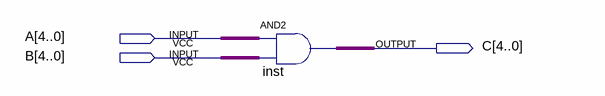
[diagram p0: schematic sheet]
// Quartus schematic and_module.bdf as structural Verilog: 1 symbols, 3 pins
module and_module (
  input  [4:0] A,
  input  [4:0] B,
  output [4:0] C
);

  assign C = A & B;  // AND2 inst, 5 bits wide
endmodule
